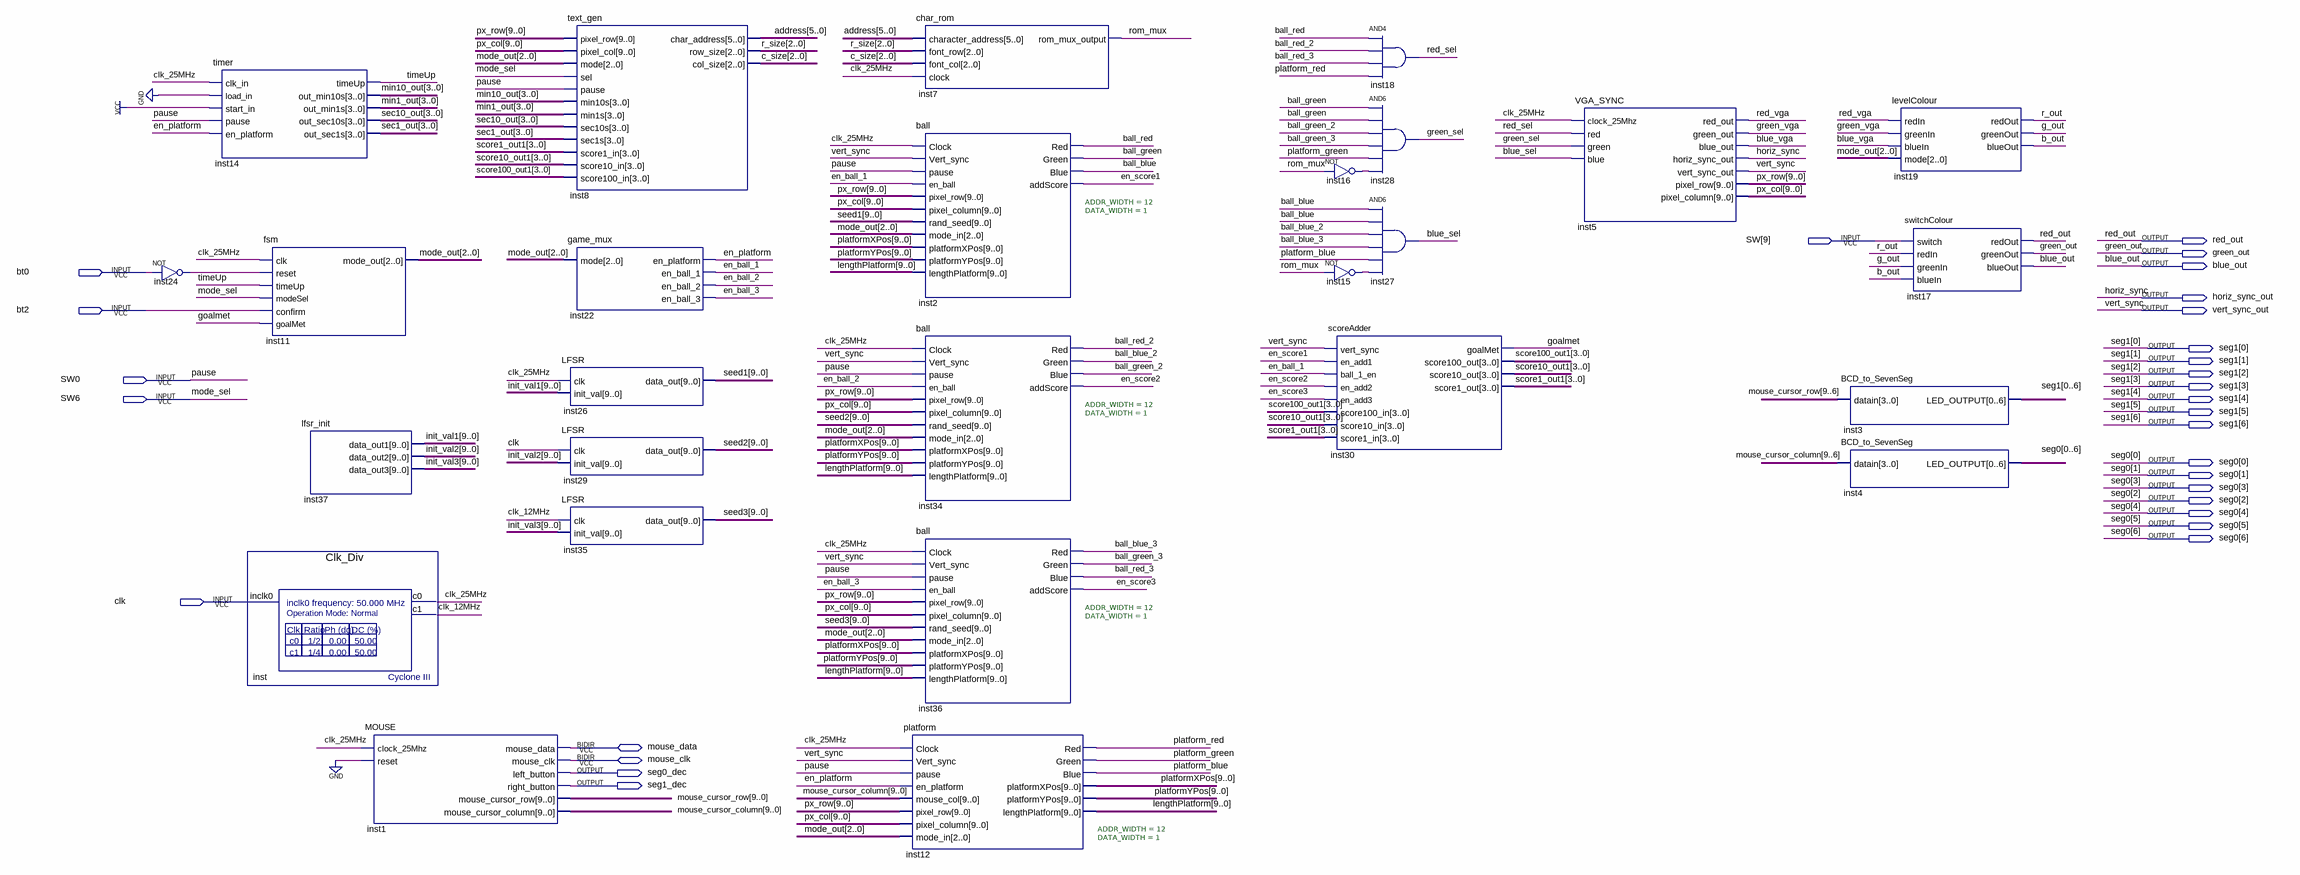
[diagram p0: schematic sheet]
// Quartus schematic 305_Project.bdf as structural Verilog: 27 symbols, 29 pins
module \305_Project  (
  input  [9:9] SW,
  input  bt0,
  input  bt2,
  input  SW0,
  input  SW6,
  input  clk,
  inout  mouse_data,
  inout  mouse_clk,
  output red_out,
  output green_out,
  output blue_out,
  output horiz_sync_out,
  output vert_sync_out,
  output [6:0] seg1,
  output [6:0] seg0,
  output seg0_dec,
  output seg1_dec
);

  wire b_out, ball_blue, ball_blue_2, ball_blue_3, ball_green, ball_green_2, ball_green_3, ball_red,
       ball_red_2, ball_red_3, blue_sel, blue_vga, clk_12MHz, clk_25MHz, en_ball_1, en_ball_2, en_ball_3,
       en_platform, en_score1, en_score2, en_score3, g_out, goalmet, green_sel, green_vga, inst15_out,
       inst16_out, inst24_out, platform_blue, platform_green, platform_red, r_out, red_sel, red_vga, rom_mux,
       timeUp;
  wire [2:0] c_size, mode_out, r_size;
  wire [3:0] min1_out, min10_out, score1_out1, score10_out1, score100_out1, sec1_out, sec10_out;
  wire [5:0] address;
  wire [9:0] init_val1, init_val2, init_val3, lengthPlatform, mouse_cursor_column, mouse_cursor_row,
       platformXPos, platformYPos, px_col, px_row, seed1, seed2, seed3;

  not inst24 (inst24_out, bt0);
  timer inst14 (
    .clk_in(clk_25MHz), .load_in(1'b0), .start_in(1'b1), .pause(SW0), .en_platform(en_platform),
    .timeUp(timeUp), .out_min10s(min10_out), .out_min1s(min1_out), .out_sec10s(sec10_out),
    .out_sec1s(sec1_out));
  fsm inst11 (
    .clk(clk_25MHz), .reset(inst24_out), .timeUp(timeUp), .modeSel(SW6), .confirm(bt2), .goalMet(goalmet),
    .mode_out(mode_out));
  Clk_Div inst (.inclk0(clk), .c0(clk_25MHz), .c1(clk_12MHz));
  lfsr_init inst37 (.data_out1(init_val1), .data_out2(init_val2), .data_out3(init_val3));
  MOUSE inst1 (
    .clock_25Mhz(clk_25MHz), .reset(1'b0), .left_button(seg0_dec), .right_button(seg1_dec),
    .mouse_cursor_row(mouse_cursor_row), .mouse_cursor_column(mouse_cursor_column), .mouse_data(mouse_data),
    .mouse_clk(mouse_clk));
  text_gen inst8 (
    .pixel_row(px_row), .pixel_col(px_col), .mode(mode_out), .sel(SW6), .pause(SW0), .min10s(min10_out),
    .min1s(min1_out), .sec10s(sec10_out), .sec1s(sec1_out), .score1_in(score1_out1),
    .score10_in(score10_out1), .score100_in(score100_out1), .char_address(address), .row_size(r_size),
    .col_size(c_size));
  game_mux inst22 (
    .mode(mode_out), .en_platform(en_platform), .en_ball_1(en_ball_1), .en_ball_2(en_ball_2),
    .en_ball_3(en_ball_3));
  LFSR inst26 (.clk(clk_25MHz), .init_val(init_val1), .data_out(seed1));
  LFSR inst29 (.clk(clk), .init_val(init_val2), .data_out(seed2));
  LFSR inst35 (.clk(clk_12MHz), .init_val(init_val3), .data_out(seed3));
  char_rom inst7 (
    .character_address(address), .font_row(r_size), .font_col(c_size), .clock(clk_25MHz),
    .rom_mux_output(rom_mux));
  ball #(.ADDR_WIDTH(12), .DATA_WIDTH(1)) inst2 (
    .Clock(clk_25MHz), .Vert_sync(vert_sync_out), .pause(SW0), .en_ball(en_ball_1), .pixel_row(px_row),
    .pixel_column(px_col), .rand_seed(seed1), .mode_in(mode_out), .platformXPos(platformXPos),
    .platformYPos(platformYPos), .lengthPlatform(lengthPlatform), .Red(ball_red), .Green(ball_green),
    .Blue(ball_blue), .addScore(en_score1));
  ball #(.ADDR_WIDTH(12), .DATA_WIDTH(1)) inst34 (
    .Clock(clk_25MHz), .Vert_sync(vert_sync_out), .pause(SW0), .en_ball(en_ball_2), .pixel_row(px_row),
    .pixel_column(px_col), .rand_seed(seed2), .mode_in(mode_out), .platformXPos(platformXPos),
    .platformYPos(platformYPos), .lengthPlatform(lengthPlatform), .Red(ball_red_2), .Green(ball_blue_2),
    .Blue(ball_green_2), .addScore(en_score2));
  ball #(.ADDR_WIDTH(12), .DATA_WIDTH(1)) inst36 (
    .Clock(clk_25MHz), .Vert_sync(vert_sync_out), .pause(SW0), .en_ball(en_ball_3), .pixel_row(px_row),
    .pixel_column(px_col), .rand_seed(seed3), .mode_in(mode_out), .platformXPos(platformXPos),
    .platformYPos(platformYPos), .lengthPlatform(lengthPlatform), .Red(ball_blue_3), .Green(ball_green_3),
    .Blue(ball_red_3), .addScore(en_score3));
  platform #(.ADDR_WIDTH(12), .DATA_WIDTH(1)) inst12 (
    .Clock(clk_25MHz), .Vert_sync(vert_sync_out), .pause(SW0), .en_platform(en_platform),
    .mouse_col(mouse_cursor_column), .pixel_row(px_row), .pixel_column(px_col), .mode_in(mode_out),
    .Red(platform_red), .Green(platform_green), .Blue(platform_blue), .platformXPos(platformXPos),
    .platformYPos(platformYPos), .lengthPlatform(lengthPlatform));
  not inst16 (inst16_out, rom_mux);
  not inst15 (inst15_out, rom_mux);
  scoreAdder inst30 (
    .vert_sync(vert_sync_out), .en_add1(en_score1), .ball_1_en(en_ball_1), .en_add2(en_score2),
    .en_add3(en_score3), .score100_in(score100_out1), .score10_in(score10_out1), .score1_in(score1_out1),
    .goalMet(goalmet), .score100_out(score100_out1), .score10_out(score10_out1), .score1_out(score1_out1));
  and inst18 (red_sel, ball_red, ball_red_2, ball_red_3, platform_red);
  and inst28 (green_sel, ball_green, ball_green, ball_green_2, ball_green_3, platform_green, inst16_out);
  and inst27 (blue_sel, ball_blue, ball_blue, ball_blue_2, ball_blue_3, platform_blue, inst15_out);
  VGA_SYNC inst5 (
    .clock_25Mhz(clk_25MHz), .red(red_sel), .green(green_sel), .blue(blue_sel), .red_out(red_vga),
    .green_out(green_vga), .blue_out(blue_vga), .horiz_sync_out(horiz_sync_out),
    .vert_sync_out(vert_sync_out), .pixel_row(px_row), .pixel_column(px_col));
  BCD_to_SevenSeg inst3 (
    .datain(mouse_cursor_row[9:6]),
    .LED_OUTPUT({seg1[0], seg1[1], seg1[2], seg1[3], seg1[4], seg1[5], seg1[6]}));
  BCD_to_SevenSeg inst4 (
    .datain(mouse_cursor_column[9:6]),
    .LED_OUTPUT({seg0[0], seg0[1], seg0[2], seg0[3], seg0[4], seg0[5], seg0[6]}));
  levelColour inst19 (
    .redIn(red_vga), .greenIn(green_vga), .blueIn(blue_vga), .mode(mode_out), .redOut(r_out),
    .greenOut(g_out), .blueOut(b_out));
  switchColour inst17 (
    .switch(SW[9]), .redIn(r_out), .greenIn(g_out), .blueIn(b_out), .redOut(red_out), .greenOut(green_out),
    .blueOut(blue_out));

  // Other names for the same wires on the sheet: horiz_sync = horiz_sync_out; mode_sel = SW6; pause = SW0;
  //   vert_sync = vert_sync_out
endmodule
